# EasyEDA Pro project USB拓展坞.eprj

# Schematic Schematic1
Board Name: Board1; Create Date: 2025-09-06; Page Name: P1; Project Name: USB拓展坞; Schematic Name: Schematic1; Update Date: 2025-09-06; Company: Michel Johnson; Drawed: Michel Johnson; Page Size: A4; Version: V1.0
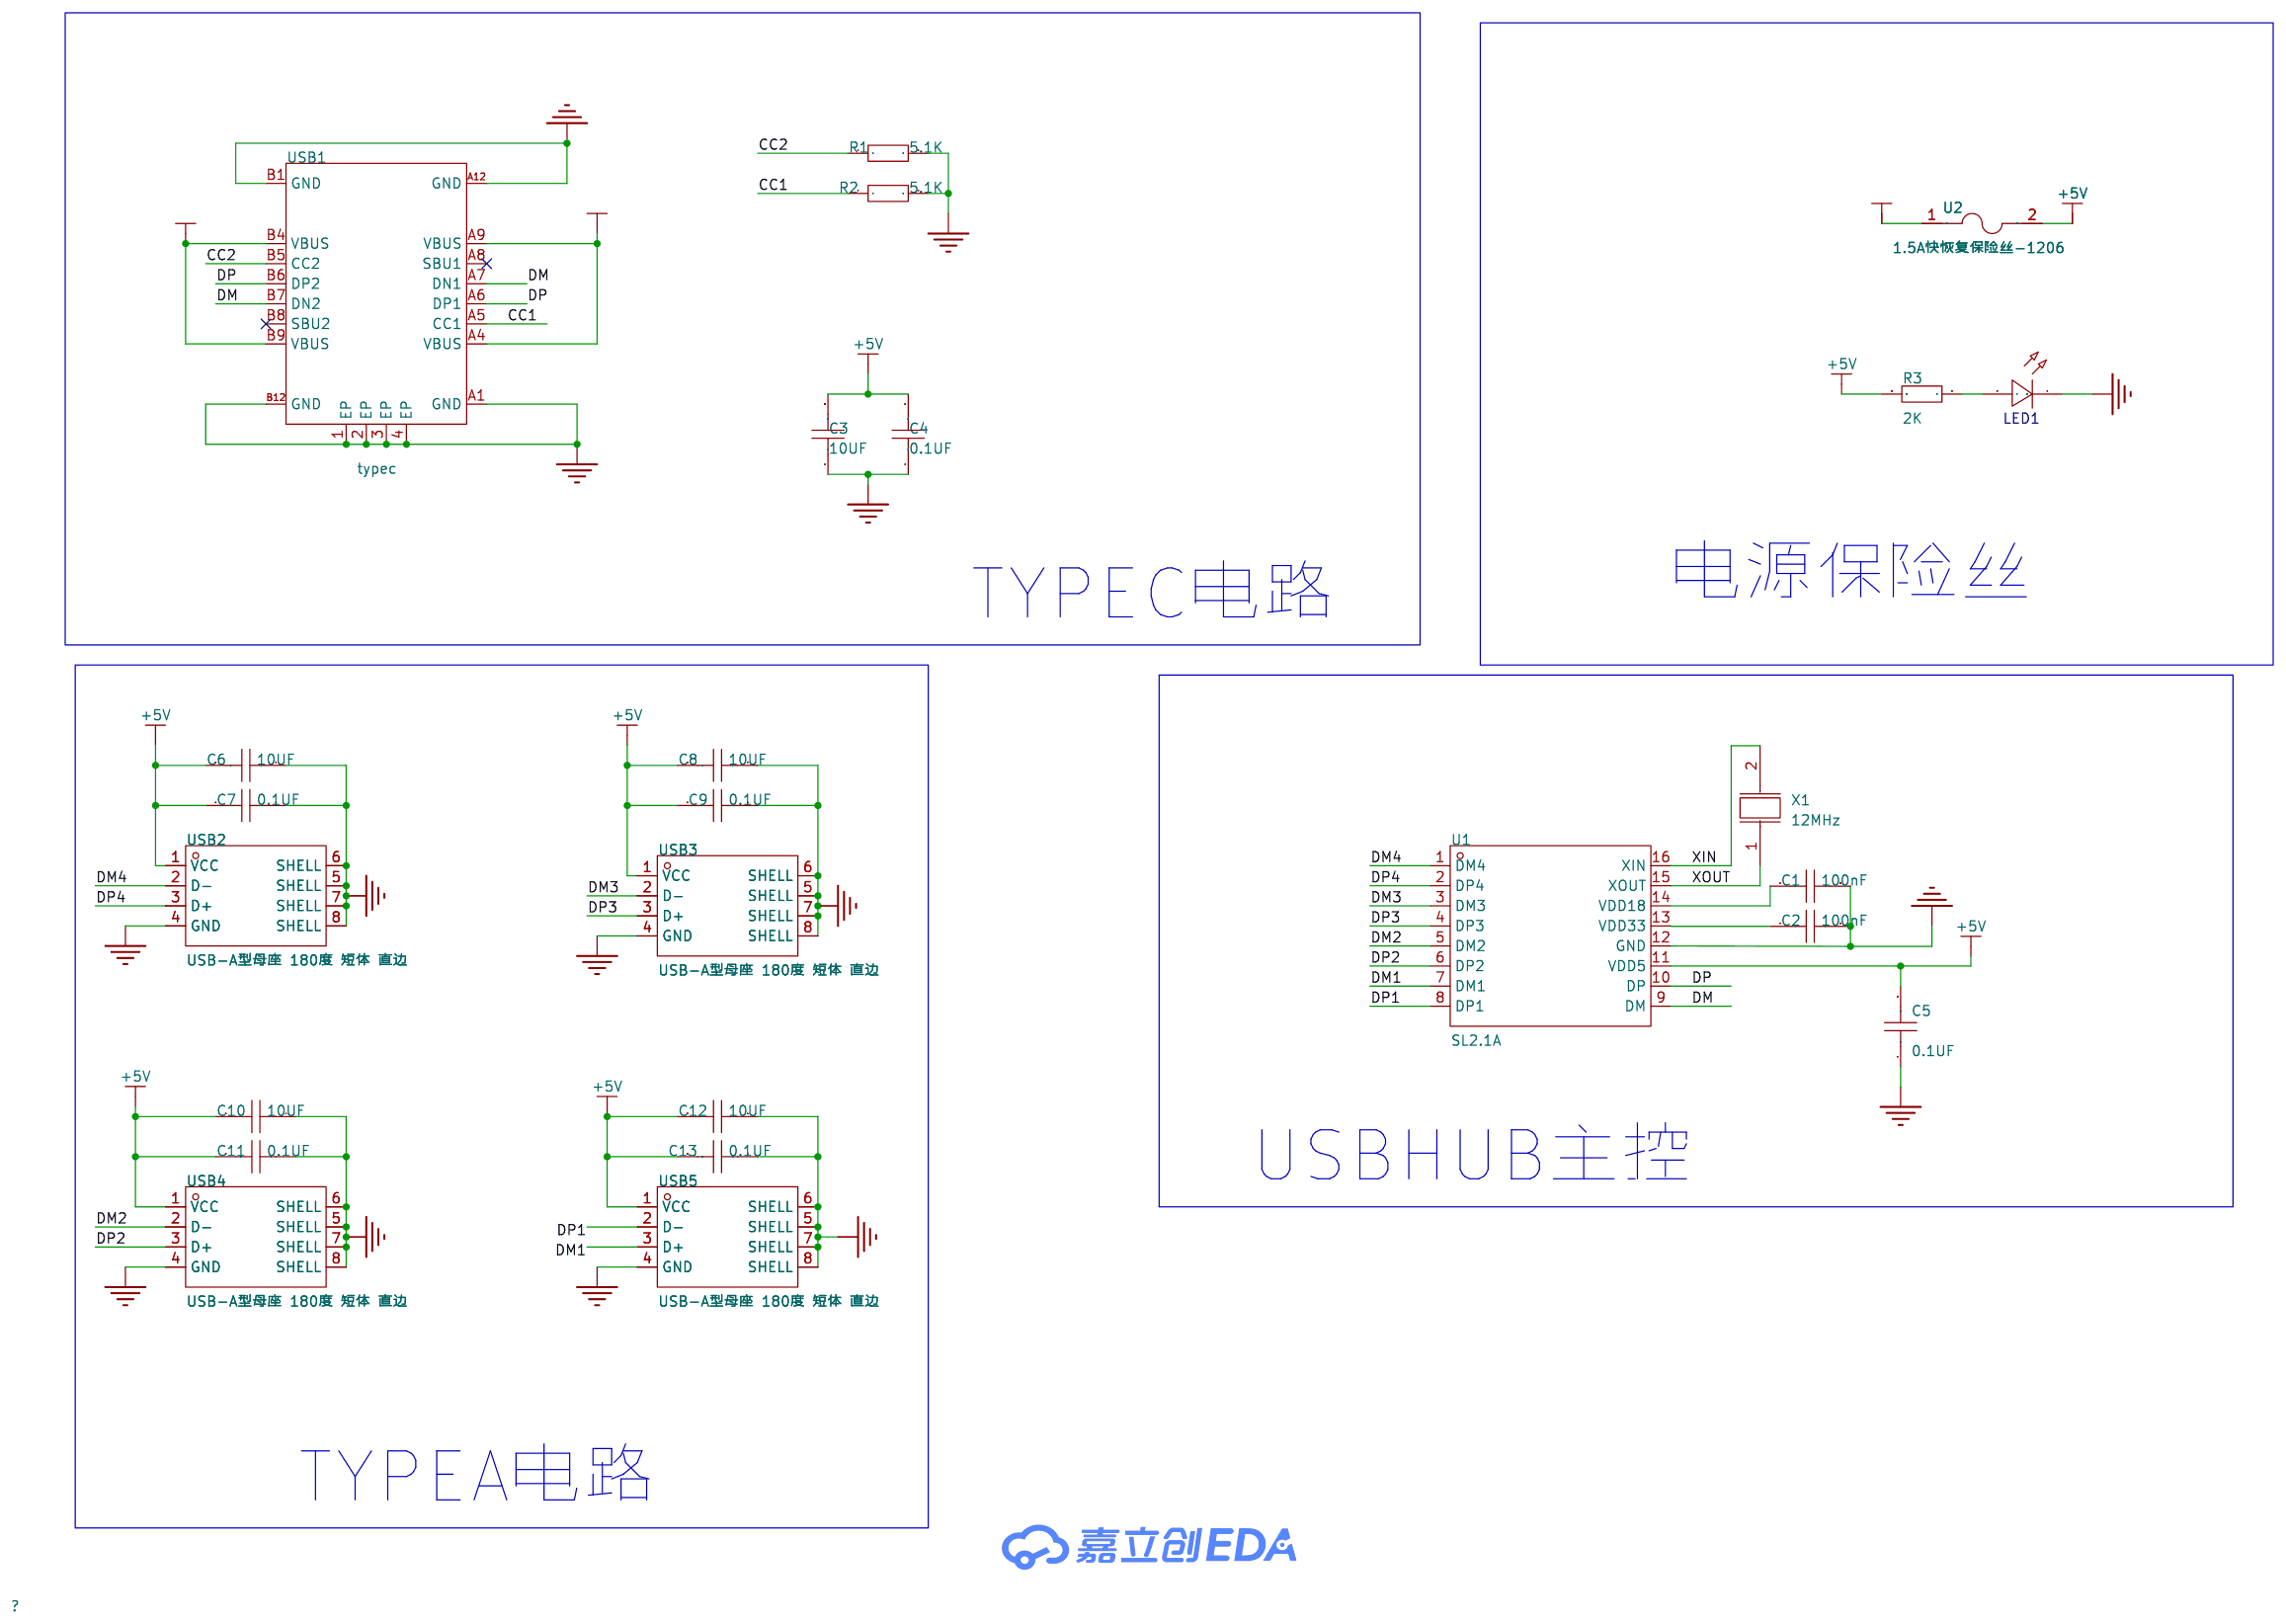
[diagram p0: schematic sheet]

## Parts
C1  100nF  [C0805]
C2  100nF  [C0805]
C3  10UF  [C0805]
C4  0.1UF  [C0805]
C5  0.1UF  [C0805]
C6  10UF  [C0805]
C7  0.1UF  [C0805]
C8  10UF  [C0805]
C9  0.1UF  [C0805]
C10  10UF  [C0805]
C11  0.1UF  [C0805]
C12  10UF  [C0805]
C13  0.1UF  [C0805]
LED1  -  [LED_0805]
R1  5.1K  [R0603]
R2  5.1K  [R0603]
R3  2K  [R0603]
U1  SL2.1A  [SOP-16_L10.0-W3.9-P1.27-LS6.0-BL]
U2  1.5A快恢复保险丝-1206  [F1206]
USB1  typec  [USB-C-SMD_KH-TYPE-C-16P]
USB2  USB-A型母座 180度 短体 直边  [USB-A-SMD_WT_C9900004571]
USB3  USB-A型母座 180度 短体 直边  [USB-A-SMD_WT_C9900004571]
USB4  USB-A型母座 180度 短体 直边  [USB-A-SMD_WT_C9900004571]
USB5  USB-A型母座 180度 短体 直边  [USB-A-SMD_WT_C9900004571]
X1  12MHz  [CRYSTAL-SMD_L5.0-W3.2-1-A]

## Library data of the parts
C1-C13 = CAP_0805: Supplier Footprint: 0805
LED1 = LED_0805-G: Supplier Footprint: 0805
R1-R3 = Res_0603: Supplier Footprint: 0603
U1 = SL2.1A: SL2.1A是一颗高集成度,高性能,低功耗的USB2.0集线器主控芯片，支持USB2.0高速(480MHz),全速(12MHz)和低速模式(1.5MHz)，内置12MHz晶体振荡器。; LCSC Part Name: USB2.0高速4端口HUB控制器; Supplier Part: C192893; Manufacturer: CoreChips(和芯润德); Supplier Footprint: SOP-16; JLCPCB Part Class: 扩展库; Datasheet: https://item.szlcsc.com/datasheet/SL2.1A/225853.html; Supplier: LCSC
U2 = 1.5A快恢复保险丝-1206: Supplier Part: C9900012139; JLCPCB Part Class: 扩展库; Supplier: LCSC
USB1 = typec: Supplier Part: C9900016956; Supplier Footprint: typec 12p; JLCPCB Part Class: 扩展库; Supplier: LCSC
USB2-USB5 = USB-A型母座 180度 短体 直边: Supplier Part: C9900004571; Supplier Footprint: SMD; JLCPCB Part Class: 扩展库; Supplier: LCSC
X1 = G5312000202090: 晶振类型:贴片晶振;频率:12MHz;常温频差:±20ppm;负载电容:20pF;; LCSC Part Name: 12MHz ±20ppm 20pF; Supplier Part: C479171; Manufacturer: JGHC(晶光华); Supplier Footprint: SMD5032-2P; JLCPCB Part Class: 扩展库; Datasheet: https://item.szlcsc.com/datasheet/G5312000202090/486540.html; Supplier: LCSC; Type: 贴片晶振; Normal temperature Frequency Tolerance: ±20ppm; Load Capacitance: 20pF; Equivalent Series Resistance(ESR): 90Ω; Operating Temperature: -40℃~+85℃

## Nets
+5V: C3.2 C4.2 C5.2 C6.2 C7.2 C8.2 C9.2 C10.2 C11.2 C12.2 C13.2 R3.2 U1.11(VDD5) U2.2 USB2.1(VCC) USB3.1(VCC) USB4.1(VCC) USB5.1(VCC)
GND: C1.2 C2.2 C3.1 C4.1 C5.1 C6.1 C7.1 C8.1 C9.1 C10.1 C11.1 C12.1 C13.1 LED1.1(C) R1.2 R2.2 U1.12(GND) USB1.1(EP) USB1.2(EP) USB1.3(EP) USB1.4(EP) USB1.A1(GND) USB1.A12(GND) USB1.B1(GND) USB1.B12(GND) USB2.4(GND) USB2.5(SHELL) USB2.6(SHELL) USB2.7(SHELL) USB2.8(SHELL) USB3.4(GND) USB3.5(SHELL) USB3.6(SHELL) USB3.7(SHELL) USB3.8(SHELL) USB4.4(GND) USB4.5(SHELL) USB4.6(SHELL) USB4.7(SHELL) USB4.8(SHELL) USB5.4(GND) USB5.5(SHELL) USB5.6(SHELL) USB5.7(SHELL) USB5.8(SHELL)
VCC+5V: U2.1 USB1.A4(VBUS) USB1.A9(VBUS) USB1.B4(VBUS) USB1.B9(VBUS)
CC1: R2.1 USB1.A5(CC1)
CC2: R1.1 USB1.B5(CC2)
DM: U1.9(DM) USB1.A7(DN1) USB1.B7(DN2)
DM1: U1.7(DM1) USB5.3(D+)
DM2: U1.5(DM2) USB4.2(D-)
DM3: U1.3(DM3) USB3.2(D-)
DM4: U1.1(DM4) USB2.2(D-)
DP: U1.10(DP) USB1.A6(DP1) USB1.B6(DP2)
DP1: U1.8(DP1) USB5.2(D-)
DP2: U1.6(DP2) USB4.3(D+)
DP3: U1.4(DP3) USB3.3(D+)
DP4: U1.2(DP4) USB2.3(D+)
XIN: U1.16(XIN) X1.2
XOUT: U1.15(XOUT) X1.1
$1N875: C1.1 U1.14(VDD18)
Net-(LED1-2): LED1.2(A) R3.1

Not connected (* = marked no-connect by the designer): C2 1; U1 13(VDD33); USB1 A8(SBU1)* B8(SBU2)*

## Notes on the sheet
- 电源保险丝
- TYPEC电路
- USBHUB主控
- TYPEA电路

# Board PCB1
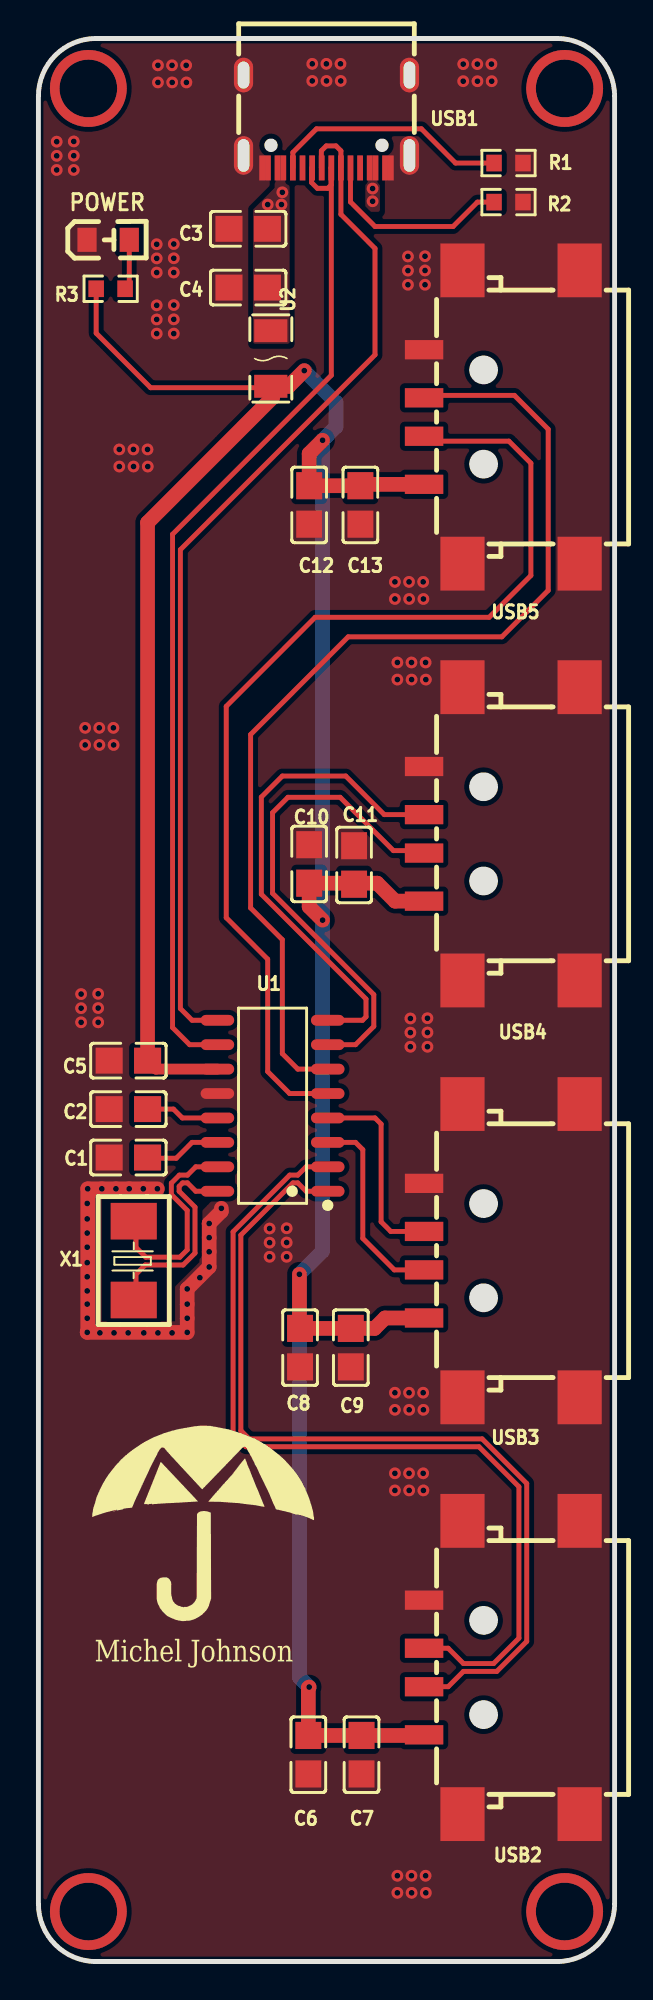
[diagram p1: board, top side]
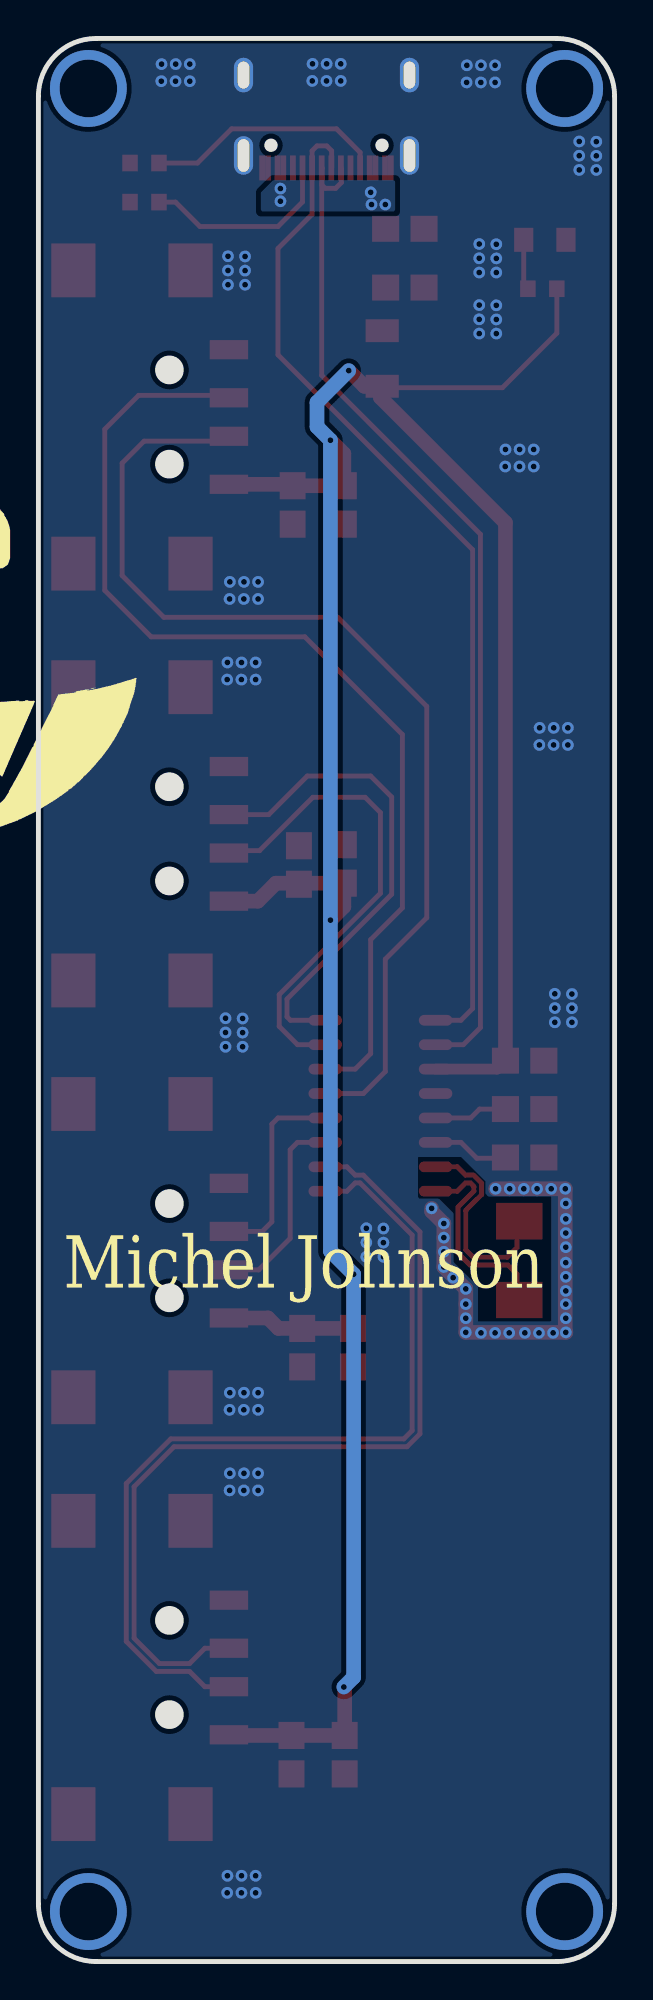
[diagram p2: board, bottom side, seen from below]

Outline 30 x 100 mm; copper layers: Top Layer, Bottom Layer. Coordinates in mm from the lower left corner of the outline.
Outline path: 0,97 0,3 arc(0.88,0.88) 3,0 27,0 arc(29.12,0.88) 30,3 30,97 arc(29.12,99.12) 27,100 3,100 arc(0.88,99.12) 0,97
Stack: Top Layer 0.035mm / Dielectric1 1.51mm FR4 er 4.5 / Bottom Layer 0.035mm

## Design rules (mm)
net DM4: DP4
net DP4: DP4
net DM3: DP3
net DP3: DP3
net DM2: DP2
net DP2: DP2
net DM1: DP1
net DP1: DP1
net XIN: DP6
net XOUT: DP6
net DP: DP5
net DM: DP5
template: 自定义配置
spacing copperThickness1oz (default): track to track 0.102, other pairs 0.152 to 0.3
spacing copperThickness2oz: track to track 0.203, other pairs 0.152 to 0.3
track width copperThickness1oz (default): min 0.127, default 0.254, max 2.54
track width copperThickness2oz: min 0.203, default 0.254, max 2.54
differential pair differentialPair (default): width min 0.127, default 0.254, max 2.54; gap min 0.152, default 0.152
via viaSize (default): diameter min 0.5, default 0.61, max 10; hole min 0.3, default 0.305, max 6.3

## Placement (name value [footprint] x y rotation side)
C1  100nF  [C0805]  4.68 41.81 180 top
C2  100nF  [C0805]  4.68 44.33 180 top
C3  10UF  [C0805]  10.92 90.1 0 top
C4  0.1UF  [C0805]  10.92 87.05 0 top
C5  0.1UF  [C0805]  4.68 46.85 0 top
C6  10UF  [C0805]  14.05 10.76 90 top
C7  0.1UF  [C0805]  16.82 10.76 90 top
C8  10UF  [C0805]  13.62 31.92 90 top
C9  0.1UF  [C0805]  16.27 31.92 90 top
C10  10UF  [C0805]  14.1 57.07 270 top
C11  0.1UF  [C0805]  16.44 57.02 270 top
C12  10UF  [C0805]  14.1 75.74 90 top
C13  0.1UF  [C0805]  16.76 75.74 90 top
POWER  -  [LED_0805]  3.68 89.52 0 top
R1  5.1K  [R0603]  24.48 93.52 0 top
R2  5.1K  [R0603]  24.48 91.49 0 top
R3  2K  [R0603]  3.76 86.98 180 top
U1  SL2.1A  [SOP-16_L10.0-W3.9-P1.27-LS6.0-BL]  12.19 44.5 90 top
U2  1.5A快恢复保险丝-1206  [F1206]  12.1 83.36 270 top
USB1  typec  [USB-C-SMD_KH-TYPE-C-16P]  15 95.68 180 top
USB2  USB-A型母座 180度 短体 直边  [USB-A-SMD_WT_C9900004571]  24.13 15.29 90 top
USB3  USB-A型母座 180度 短体 直边  [USB-A-SMD_WT_C9900004571]  24.13 36.97 90 top
USB4  USB-A型母座 180度 短体 直边  [USB-A-SMD_WT_C9900004571]  24.13 58.64 90 top
USB5  USB-A型母座 180度 短体 直边  [USB-A-SMD_WT_C9900004571]  24.13 80.31 90 top
X1  12MHz  [CRYSTAL-SMD_L5.0-W3.2-1-A]  4.96 36.45 270 top

## Footprints (pads in the part's own frame, mm; a bottom-side part is the same pattern mirrored in y, then rotated)
C0805
  rect 1.41x1.35 smd: 1(-1,0) 2(1,0)
CRYSTAL-SMD_L5.0-W3.2-1-A
  rect 1.9x2.4 smd: 1(-2.05,0) 2(2.05,0)
F1206
  rect 1.19x1.728 smd: 1(-1.445,0) 2(1.445,0)
LED_0805
  rect 1x1.25 smd: 1(-1.15,0.005) 2(1.05,0.005)
R0603
  rect 0.806x0.864 smd: 1(-0.753,0) 2(0.753,0)
SOP-16_L10.0-W3.9-P1.27-LS6.0-BL
  oval 0.56x1.745 smd: 1(-4.445,-2.873) 2(-3.175,-2.873) 3(-1.905,-2.873) 4(-0.635,-2.873) 5(0.635,-2.873) 6(1.905,-2.873) 7(3.175,-2.873) 8(4.445,-2.873) 9(4.445,2.873) 10(3.175,2.873) 11(1.905,2.873) 12(0.635,2.873) 13(-0.635,2.873) 14(-1.905,2.873) 15(-3.175,2.873) 16(-4.445,2.873)
USB-A-SMD_WT_C9900004571
  rect 1x2 smd: 1(-3.5,4.05) 2(-1,4.05) 3(1,4.05) 4(3.5,4.05)
  rect 2.8x2.3 smd: 5(-7.625,2.05) 6(-7.625,-4.05) 7(7.625,-4.05) 8(7.625,2.05)
USB-C-SMD_KH-TYPE-C-16P
  oval 1x2 hole 0.6x1.7: 1(-4.32,1.765) 2(4.32,1.765)
  oval 1x1.8 hole 0.6x1.4: 3(-4.32,-2.415) 4(4.32,-2.415)
  rect 0.3x1.3 smd: A1(-3.35,2.415) A4(-2.55,2.415) A5(-1.25,2.415) A6(-0.25,2.415) A7(0.25,2.415) A8(1.25,2.415) A9(2.55,2.415) A12(3.35,2.415) B1(3.05,2.415) B4(2.25,2.415) B5(1.75,2.415) B6(0.75,2.415) B7(-0.75,2.415) B8(-1.75,2.415) B9(-2.25,2.415) B12(-3.05,2.415)

## Nets
+5V: C5.2 C6.2 C7.2 C8.2 C9.2 C10.2 C11.2 C12.2 C13.2 R3.2 U1.11 U2.2 USB2.1 USB3.1 USB4.1 USB5.1
GND: C1.2 C2.2 C3.1 C4.1 C5.1 C6.1 C7.1 C8.1 C9.1 C10.1 C11.1 C12.1 C13.1 POWER.1 R1.2 R2.2 U1.12 USB1.1 USB1.2 USB1.3 USB1.4 USB1.A1 USB1.A12 USB1.B1 USB1.B12 USB2.4 USB2.5 USB2.6 USB2.7 USB2.8 USB3.4 USB3.5 USB3.6 USB3.7 USB3.8 USB4.4 USB4.5 USB4.6 USB4.7 USB4.8 USB5.4 USB5.5 USB5.6 USB5.7 USB5.8
VCC+5V: C3.2 C4.2 U2.1 USB1.A4 USB1.A9 USB1.B4 USB1.B9
CC1: R2.1 USB1.A5
CC2: R1.1 USB1.B5
DM: U1.9 USB1.A7 USB1.B7
DM1: U1.7 USB4.2
DM2: U1.5 USB5.2
DM3: U1.3 USB3.2
DM4: U1.1 USB2.2
DP: U1.10 USB1.A6 USB1.B6
DP1: U1.8 USB4.3
DP2: U1.6 USB5.3
DP3: U1.4 USB3.3
DP4: U1.2 USB2.3
XIN: U1.16 X1.2
XOUT: U1.15 X1.1
$1N871: C2.1 U1.13
$1N875: C1.1 U1.14
$1N2545: POWER.2 R3.1

Pads without a net: USB1 A8 B8

## Via types
v1: diameter 4, hole 3, Top Layer to Bottom Layer, 4 vias
v2: diameter 0.61, hole 0.305, Top Layer to Bottom Layer, 144 vias

## Routing (per net, layer and track width the routed paths; a pad name or vN(x,y) marks a point on that pad's centre or on a via; arc(x,y) is an arc through that point)
+5V: length 161.6
  Top Layer w0.254: R3.2 3.01,84.67 5.84,81.84 11.54,81.84 11.72,81.66
  Top Layer w0.559: U1.11 6.12,46.41 C5.2
  Top Layer w0.762: USB4.1 18.57,55.14 17.64,56.07 C10.2 14.1,54.85 v2(14.8,54.15) ; C5.2 5.68,74.82 12.19,81.33 12.19,81.82 U2.2 13.03,81.91 v2(13.84,82.73) ; C12.2 14.1,78.41 v2(14.8,79.11) ; C12.2 14.1,76.62 ; C12.2 C13.2 16.96,76.94 ; USB3.1 18.05,33.47 17.5,32.92 C9.2 C8.2 13.59,32.96 v2(13.59,35.74) ; USB2.1 20.04,11.76 C7.2 C6.2 14.05,14.23 v2(14.1,14.28) ; 16.96,76.81 USB5.1
  Bottom Layer w0.762: v2(14.1,14.28) 13.59,14.78 v2(13.59,35.74) 14.8,36.94 v2(14.8,54.15) v2(14.8,79.11) 15.49,79.81 15.49,81.08 v2(13.84,82.73)
GND: length 23.5
  Top Layer w0.762: v2(6.2,40.18) v2(5.46,40.18) v2(4.73,40.18) v2(4.04,40.18) v2(3.3,40.18) v2(2.57,40.18) 2.57,32.74 v2(2.54,32.72) v2(7.75,32.72) v2(7.75,33.45) v2(7.75,34.19) v2(7.75,34.98) 7.75,34.98 v2(8.89,36.12) 8.89,38.38 ; v2(9.53,39.17) 9.53,39.01 8.89,38.38 ; 8.89,38.38 v2(8.89,38.38)
  vias: v2(0.95,94.63) v2(0.95,93.9) v2(0.95,93.16) v2(1.84,94.65) v2(1.84,93.9) v2(1.84,93.16) v2(2.22,50.31) v2(2.22,49.57) v2(2.22,48.84) v2(2.43,64.15) v2(2.43,63.26) v2(2.54,39.42) v2(2.54,38.62) v2(2.54,37.88) v2(2.54,37.15) v2(2.54,36.34) v2(2.54,35.61) v2(2.54,34.87) v2(2.54,34.19) v2(2.54,33.45) v2(3.11,50.32) v2(3.11,49.58) v2(3.11,48.84) v2(3.17,64.15) v2(3.18,63.26) v2(3.2,32.69) v2(3.9,64.15) v2(3.92,63.26) v2(3.94,32.69) v2(4.21,78.63) v2(4.21,77.74) v2(4.67,32.69) v2(4.95,78.63) v2(4.95,77.74) v2(5.49,32.69) v2(5.68,78.63) v2(5.69,77.74) v2(6.22,98.6) v2(6.22,97.71) v2(6.16,89.3) v2(6.16,88.56) v2(6.16,87.83) v2(6.16,86.12) v2(6.16,85.39) v2(6.16,84.65) v2(6.22,32.69) v2(6.96,98.6) v2(6.96,97.71) v2(7.05,89.31) v2(7.05,88.57) v2(7.05,87.83) v2(7.05,86.14) v2(7.05,85.39) v2(7.05,84.65) v2(6.96,32.69) v2(7.69,98.6) v2(7.71,97.71) v2(8.41,35.56) v2(8.89,37.64) v2(8.89,36.91) v2(12.04,38.12) v2(12.04,37.38) v2(12.04,36.65) v2(12.93,38.13) v2(12.93,37.39) v2(12.93,36.65) v2(14.26,98.68) v2(14.26,97.79) v2(14.99,98.68) v2(15,97.79) v2(15.73,98.68) v2(15.74,97.79) v2(18.56,71.74) v2(18.56,70.85) v2(18.56,29.58) v2(18.56,28.69) v2(18.56,25.39) v2(18.56,24.5) v2(18.69,67.55) v2(18.69,66.66) v2(18.69,4.46) v2(18.69,3.57) v2(19.24,88.66) v2(19.24,87.93) v2(19.24,87.19) v2(19.3,71.74) v2(19.3,70.85) v2(19.3,29.58) v2(19.3,28.69) v2(19.3,25.39) v2(19.3,24.5) v2(19.42,67.55) v2(19.43,66.66) v2(19.37,49.04) v2(19.37,48.3) v2(19.37,47.57) v2(19.42,4.46) v2(19.43,3.57) v2(20.03,71.74) v2(20.05,70.85) v2(20.03,29.58) v2(20.05,28.69) v2(20.03,25.39) v2(20.05,24.5) v2(20.13,88.68) v2(20.13,87.94) v2(20.13,87.19) v2(20.16,67.55) v2(20.17,66.66) v2(20.16,4.46) v2(20.17,3.57) v2(20.26,49.05) v2(20.26,48.31) v2(20.26,47.57) v2(22.12,98.67) v2(22.12,97.78) v2(22.85,98.67) v2(22.86,97.78) v2(23.59,98.67) v2(23.6,97.78)
VCC+5V: length 0.2
  Top Layer w0.127: v2(17.4,92.19) 17.4,92.38
  vias: v2(11.94,91.36) v2(12.7,92) v2(12.66,91.36) v2(17.4,91.53)
(no net):
  vias: v1(2.6,97.4) v1(2.6,2.6) v1(27.4,97.4) v1(27.4,2.6)
CC1: length 10.3
  Top Layer w0.254: R2.1 22.86,91.49 21.59,90.22 17.53,90.22 16.25,91.5 USB1.A5
CC2: length 12.5
  Top Layer w0.254: USB1.B5 13.25,94.07 14.48,95.3 19.94,95.3 21.72,93.52 R1.1
DM: length 53.7
  Top Layer w0.254: 15.75,93.14 15.75,90.85 17.53,89.08 17.53,83.55 7.39,73.42 7.39,49.56 8,48.95 U1.9 ; USB1.B7 15.75,94.16 15.5,94.41 14.99,94.41 14.73,94.16 14.73,93.28 USB1.A7
DM1: length 25.5
  Top Layer w0.254: USB4.2 19.95,57.77 18.48,57.77 15.71,60.54 12.99,60.54 12.19,59.74 12.19,55.55 17.46,50.28 17.46,48.63 16.51,47.68 U1.7
DM2: length 54.1
  Top Layer w0.254: USB5.2 20.33,79.06 24.5,79.06 25.64,77.91 25.64,72.07 23.47,69.9 14.41,69.9 9.78,65.27 9.78,54.28 11.94,52.12 11.94,46.28 13.08,45.14 U1.5
DM3: length 10.5
  Top Layer w0.254: U1.3 16.51,42.6 16.89,42.22 16.89,37.61 18.53,35.97 20.08,35.97
DM4: length 46.5
  Top Layer w0.254: USB2.2 21.33,14.29 22.13,15.09 23.87,15.09 25.43,16.65 25.43,24.86 23.11,27.18 10.97,27.18 10.54,27.61 10.54,37.78 13.25,40.49 13.51,40.49 13.94,40.06 U1.1
DP: length 53.7
  Top Layer w0.254: 14.22,93.27 14.22,92.51 14.52,92.21 15.07,92.21 15.24,92.38 15.24,93.25 15.22,93.27 ; USB1.A6 15.25,82.48 6.99,74.22 6.99,48.56 7.87,47.68 U1.10
DP1: length 25.5
  Top Layer w0.254: USB4.3 18.01,59.64 16,61.65 12.7,61.65 11.61,60.55 11.61,55.5 17.06,50.05 17.06,49.13 16.88,48.95 U1.8
DP2: length 54.2
  Top Layer w0.254: USB5.3 20.21,81.44 24.78,81.44 26.54,79.68 26.54,71.3 24.13,68.89 16.13,68.89 11.05,63.81 11.05,54.79 12.7,53.14 12.7,47.21 13.51,46.41 U1.6
DP3: length 10.4
  Top Layer w0.254: U1.4 17.53,43.87 17.84,43.55 17.84,38.47 18.35,37.97 USB3.3
DP4: length 46.5
  Top Layer w0.254: USB2.3 21.33,16.29 22.13,15.49 23.7,15.49 25.02,16.81 25.02,24.69 22.94,26.77 10.81,26.77 10.13,27.44 10.13,37.94 13.08,40.89 13.51,40.89 13.94,41.33 U1.2
XIN: length 11.5
  Top Layer w0.254: X1.2 5.13,34.4 5.55,34.82 5.08,35.29 5.08,35.74 5.56,36.22 7.53,36.22 8.15,36.84 8.15,39.23 7.33,40.05 7.33,40.31 7.51,40.49 7.76,40.49 8.19,40.06 U1.16
XOUT: length 11.5
  Top Layer w0.254: X1.1 5.13,38.5 5.55,38.08 5.08,37.61 5.08,37.14 5.59,36.63 7.37,36.63 7.75,37.01 7.75,39.06 6.92,39.89 6.92,40.48 7.34,40.89 7.76,40.89 8.19,41.33 U1.15
$1N871: length 3.8
  Top Layer w0.254: C2.1 7.03,44.33 7.49,43.87 U1.13
$1N875: length 4
  Top Layer w0.254: U1.14 8,42.6 7.18,41.77 5.72,41.77 C1.1
$1N2545: length 2.6
  Top Layer w0.254: R3.1 4.73,87.2 POWER.2

## Copper pours and planes (outline as drawn; the poured copper is in the pictures)
GND on Top Layer: -44.83,114.99 52.96,114.99 52.96,-22.56 -44.83,-22.56
GND on Bottom Layer: -28.96,110.41 79.76,110.41 79.76,-45.54 -28.96,-45.54
VCC+5V on Top Layer: 17.02,93.9 17.02,90.98 17.78,90.98 17.78,93.9
VCC+5V on Top Layer: 12.3,93.92 12.3,92.23 11.18,91.11 11.18,84.12 13.08,84.12 13.08,92.38 12.9,92.62 12.9,93.92
VCC+5V on Bottom Layer: 11.43,91.01 18.41,91.01 18.41,92 17.78,92.63 11.43,92.63

## Text on the board
Bottom Silkscreen Layer: Michel Johnson
Top Silkscreen Layer: Michel Johnson
